# EAGLE design M6RF-315 (EAGLE 6.1)
DESIGNER: Sandor Szilvasi; PAGE1: Cover Page; PAGE2: Radio and Antenna; REVISION: A; TITLE: M6-RF315

## Sheet 1 of 2
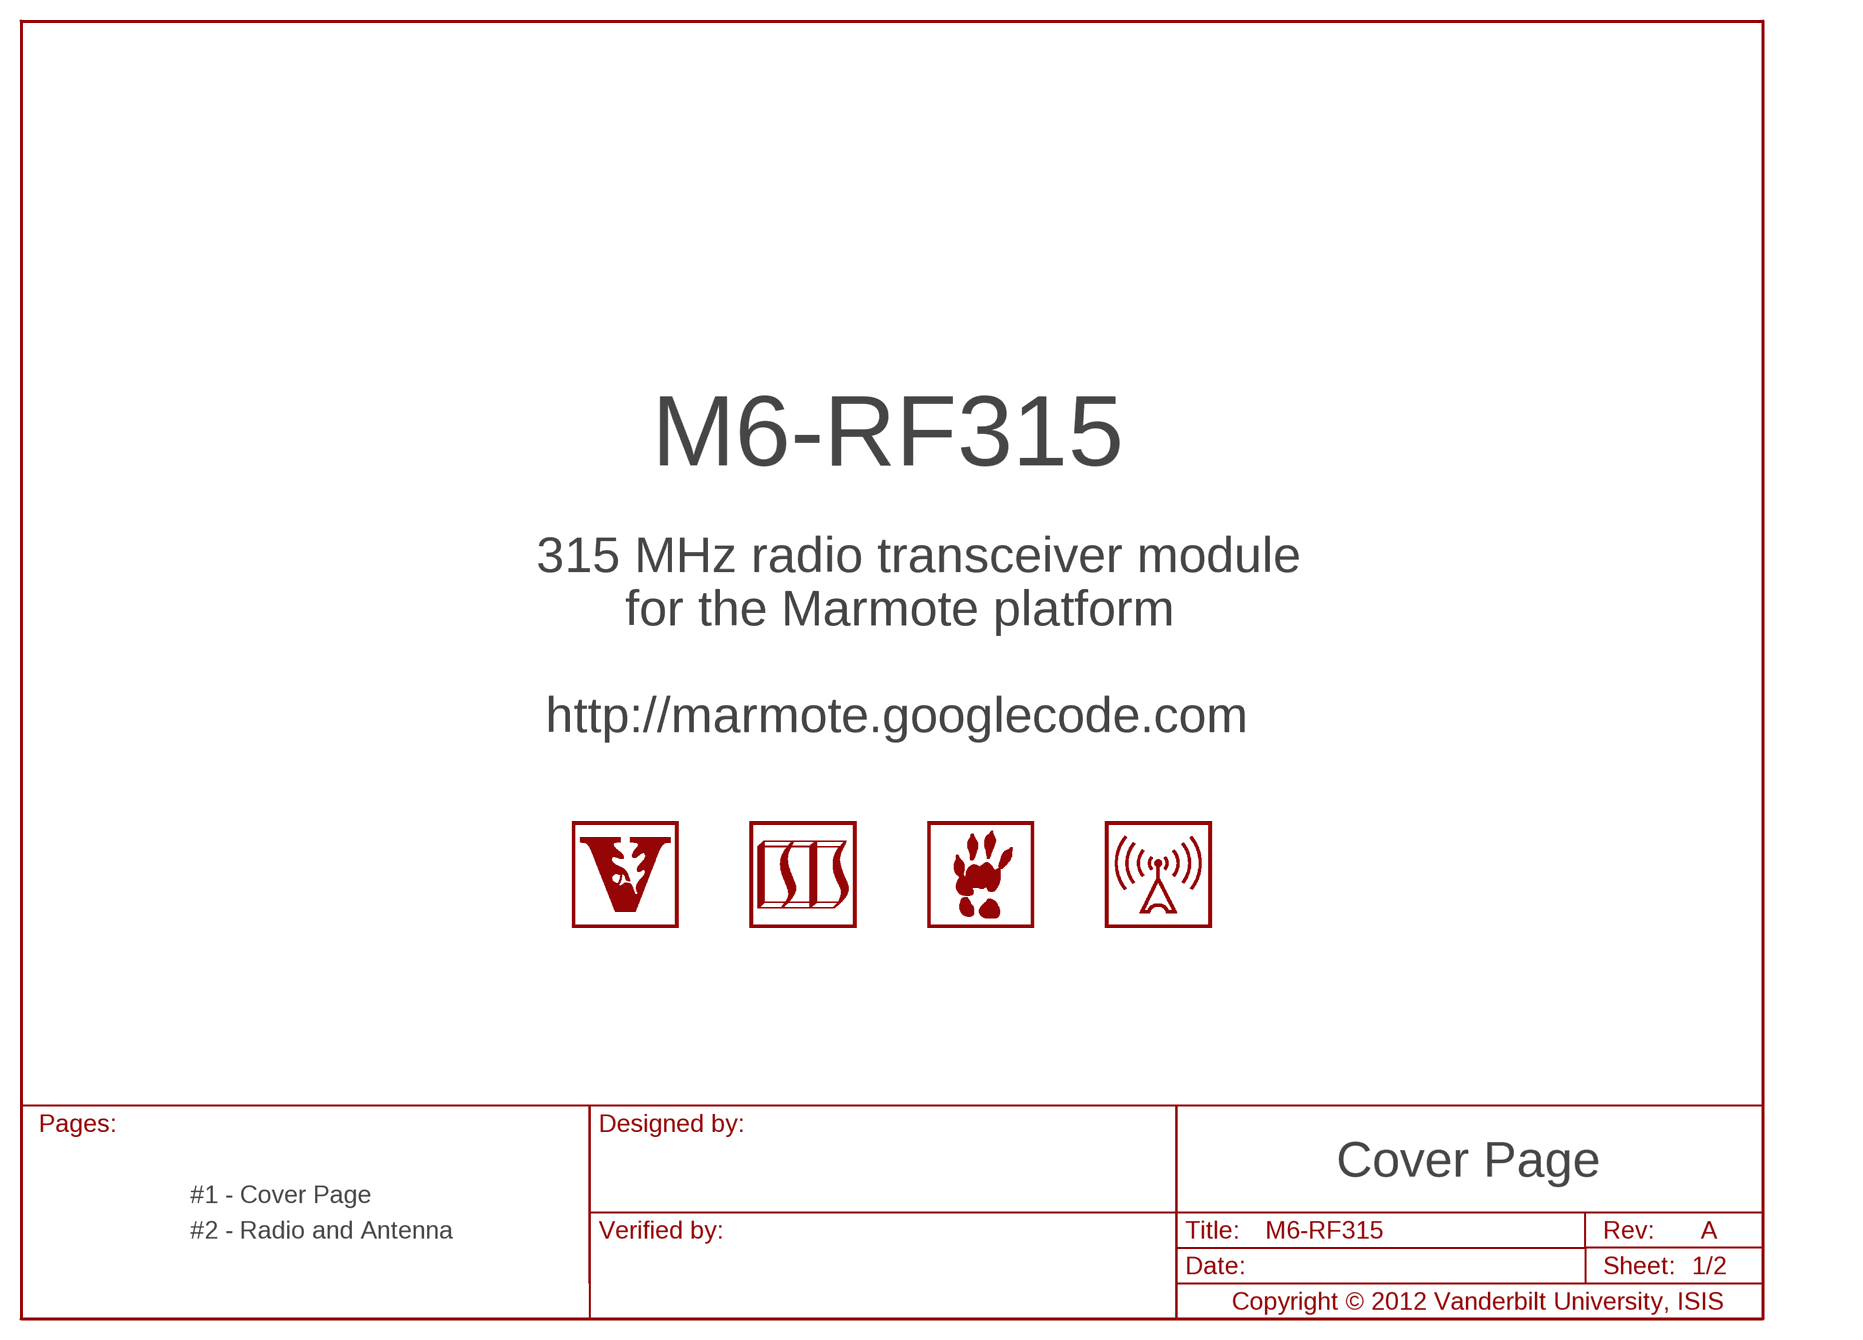
[diagram p0: schematic, sheet 1]

### Parts
LOGO1  LOGO-ISIS-600MIL-10MM-CU  [LOGO-ISIS-10MM-COPPER]
LOGO2  LOGO-MARMOTE-600MIL-10MM-CU  [LOGO-MARMOTE-10MM-COPPER]
LOGO3  LOGO-VANDERBILT-600MIL-10MM-CU  [LOGO-VANDERBILT-10MM-COPPER]
U$3  LOGO-RADIO-2-600MIL-10MM-CU  [LOGO-RADIO-2-10MM-COPPER]

### Notes on the sheet
- 315 MHz radio transceiver module
- for the Marmote platform
- http://marmote.googlecode.com

## Sheet 2 of 2
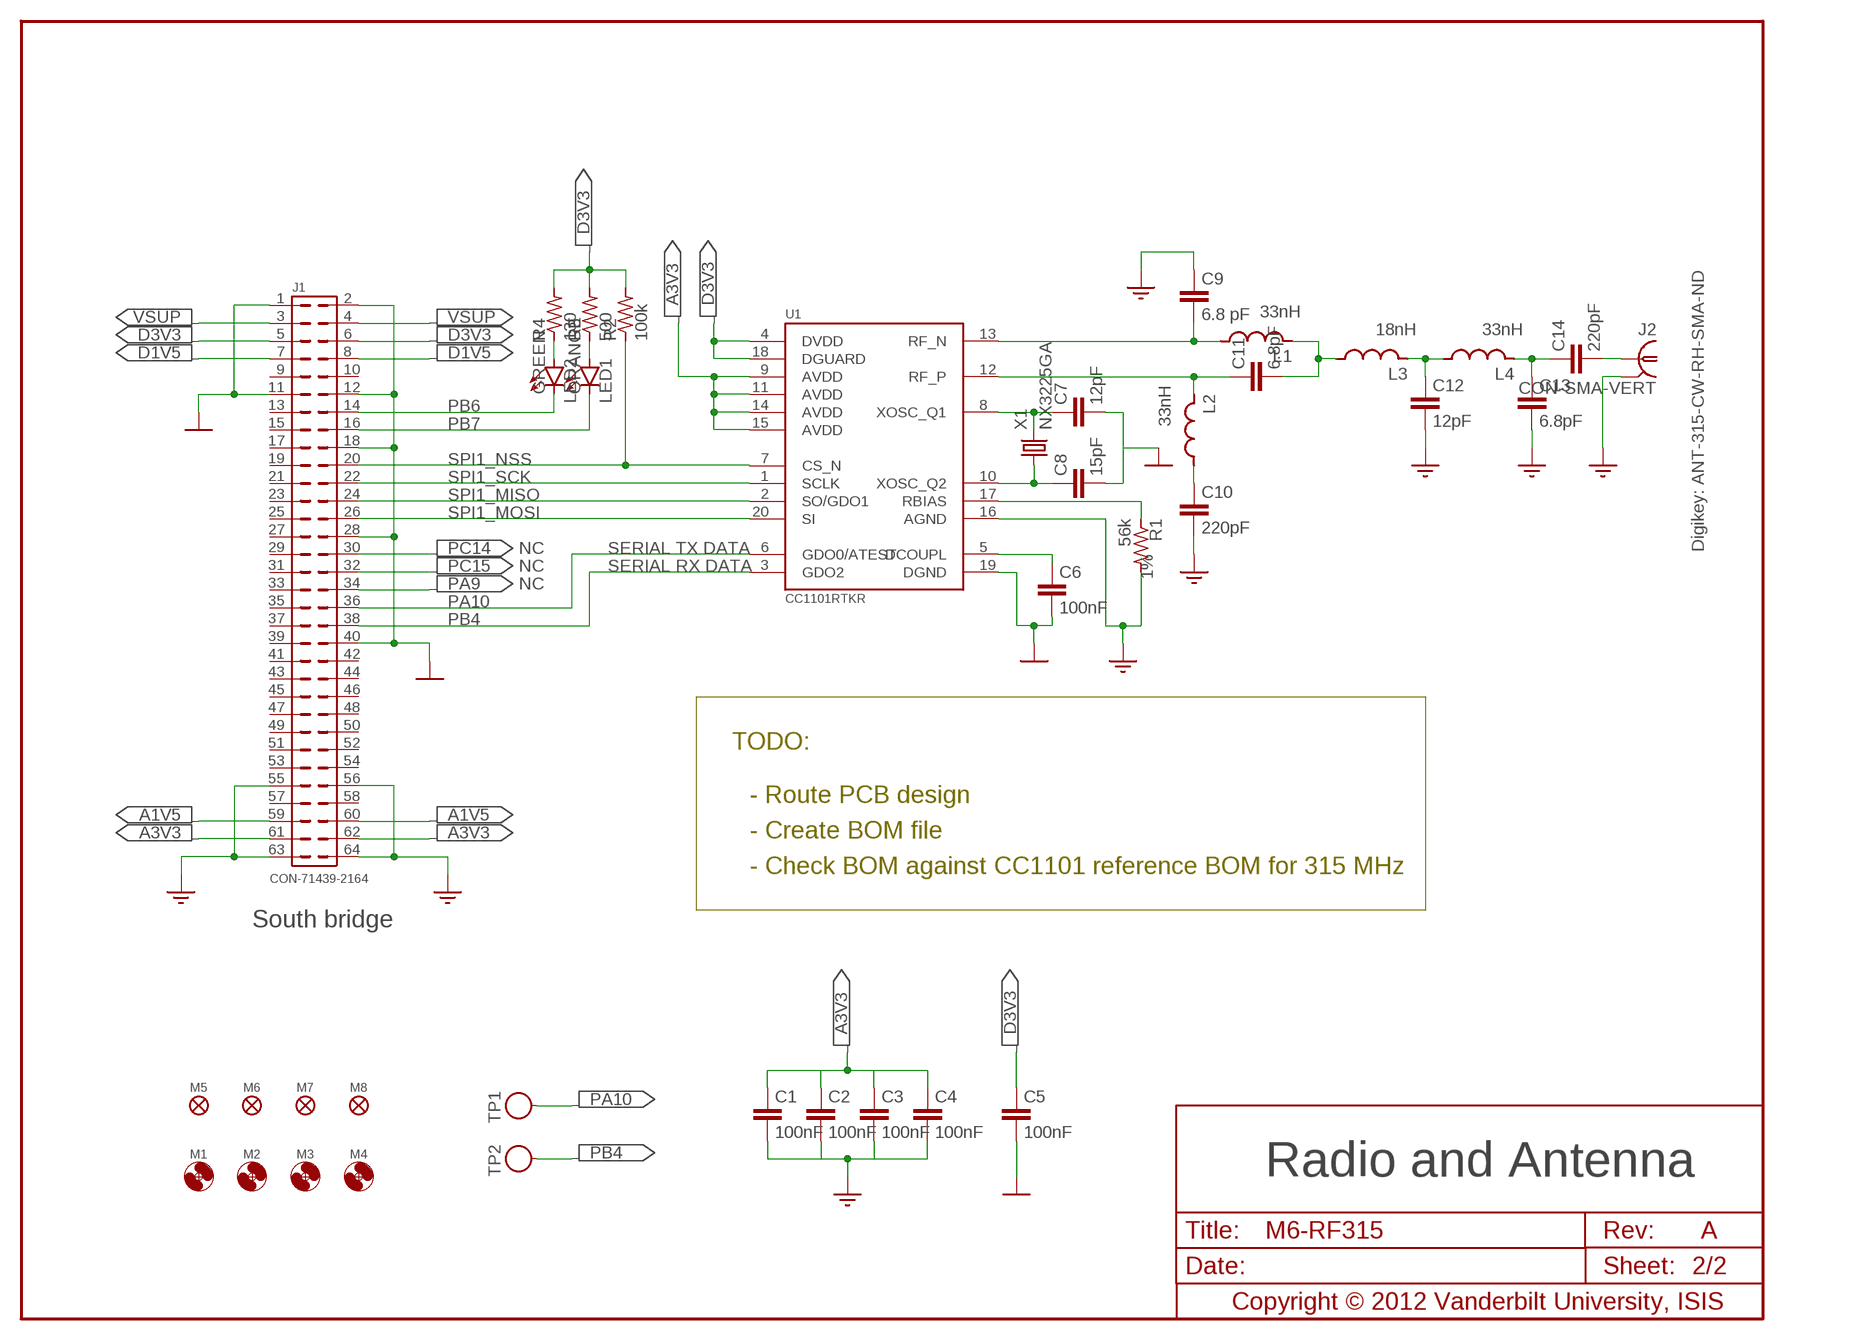
[diagram p1: schematic, sheet 2]

### Parts
C1  100nF  C0603  [C0603]
C2  100nF  C0603  [C0603]
C3  100nF  C0603  [C0603]
C4  100nF  C0603  [C0603]
C5  100nF  C0603  [C0603]
C6  100nF  C0603  [C0603]
C7  12pF  C0603  [C0603]
C8  15pF  C0603  [C0603]
C9  6.8 pF  C0603  [C0603]
C10  220pF  C0603  [C0603]
C11  6.8pF  C0603  [C0603]
C12  12pF  C0603  [C0603]
C13  6.8pF  C0603  [C0603]
C14  220pF  C0603  [C0603]
J1  CON-71439-2164  [71439-XX64-BOT]
J2  CON-SMA-VERT  [SMA-VERT]
L1  33nH  L0603  [L0603]
L2  33nH  L0603  [L0603]
L3  18nH  L0603  [L0603]
L4  33nH  L0603  [L0603]
LED1  LED0603  [LED0603]
LED2  LED0603  [LED0603]
M1  MOUNT-HOLE3.3  [3,3]
M2  MOUNT-HOLE3.3  [3,3]
M3  MOUNT-HOLE3.3  [3,3]
M4  MOUNT-HOLE3.3  [3,3]
M5  FIDUCIAL1X2  [FIDUCIAL-1X2]
M6  FIDUCIAL1X2  [FIDUCIAL-1X2]
M7  FIDUCIAL1X2  [FIDUCIAL-1X2]
M8  FIDUCIAL1X2  [FIDUCIAL-1X2]
R1  56k  R0603  [R0603]
R2  100k  R0603  [R0603]
R3  500  R0603  [R0603]
R4  130  R0603  [R0603]
TP1  TESTPOINT-RED  [TESTPOINT]
TP2  TESTPOINT-RED  [TESTPOINT]
U1  CC1101RTKR  [QFN-20]
X1  NX3225GA  [NX3225GA]

### Nets
A1V5: J1.59 J1.60
A3V3: C1.1 C2.1 C3.1 C4.1 J1.61 J1.62 U1.9(AVDD) U1.11(AVDD) U1.14(AVDD) U1.15(AVDD)
AGND: C1.2 C2.2 C3.2 C4.2 C9.1 C10.2 C12.2 C13.2 J1.55 J1.56 J1.63 J1.64 J2.2(GND) R1.2 U1.16(AGND)
D1V5: J1.7 J1.8
D3V3: C5.1 J1.5 J1.6 R2.2 R3.2 R4.2 U1.4(DVDD) U1.18(DGUARD)
DGND: C5.2 C6.2 C7.2 C8.2 J1.1 J1.2 J1.11 J1.12 J1.18 J1.28 J1.40 U1.19(DGND)
N$1: LED1.A R3.1
N$2: C12.1 L3.2 L4.1
N$3: R1.1 U1.17(RBIAS)
N$4: C6.1 U1.5(DCOUPL)
N$6: C8.1 U1.10(XOSC_Q2) X1.1
N$7: C7.1 U1.8(XOSC_Q1) X1.3
N$8: C11.1 L2.2 U1.12(RF_P)
N$9: C9.2 L1.1 U1.13(RF_N)
N$10: C11.2 L1.2 L3.1
N$11: C13.1 C14.1 L4.2
N$12: C14.2 J2.1
N$13: C10.1 L2.1
N$19: LED2.A R4.1
PA9: J1.34
PA10: J1.36 TP1.1 U1.6(GDO0/ATEST)
PB4: J1.38 TP2.1 U1.3(GDO2)
PB6: J1.14 LED2.C
PB7: J1.16 LED1.C
PC14: J1.30
PC15: J1.32
SPI1_MISO: J1.24 U1.2(SO/GDO1)
SPI1_MOSI: J1.26 U1.20(SI)
SPI1_NSS: J1.20 R2.1 U1.7(CS_N)
SPI1_SCK: J1.22 U1.1(SCLK)
VSUP: J1.3 J1.4
Unconnected: J1.9 J1.10 J1.13 J1.15 J1.17 J1.19 J1.21 J1.23 J1.25 J1.27 J1.29 J1.31 J1.33 J1.35 J1.37 J1.39 J1.41 J1.42 J1.43 J1.44 J1.45 J1.46 J1.47 J1.48 J1.49 J1.50 J1.51 J1.52 J1.53 J1.54 J1.57 J1.58 U1.E$1(AGND) U1.E$2(AGND) U1.E$3(AGND) U1.E$4(AGND)

### Notes on the sheet
- Digikey: ANT-315-CW-RH-SMA-ND
- NC | SERIAL TX DATA
- NC | SERIAL RX DATA
- NC
- TODO:
- - Route PCB design
- - Create BOM file
- - Check BOM against CC1101 reference BOM for 315 MHz
- South bridge

## Power pins joined to a net without a drawn wire
DGND: X1.2(DGND) X1.4(DGND)
GND: J2.3(GND) J2.4(GND) J2.5(GND)

## Library data of the parts
C1-C8 = M6-RF315:C: CAPACITOR
C9 = M6-RF315:C: CAPACITOR; FUNCTION: RF balun/matching capacitor
C10 = M6-RF315:C: CAPACITOR; FUNCTION: RF balun DC blocking capacitor
C11 = M6-RF315:C: CAPACITOR; FUNCTION: RF balun/matching capacitors
C12 = M6-RF315:C: CAPACITOR; FUNCTION: RF LC filter/matching filter capacitor
C13 = M6-RF315:C: CAPACITOR; FUNCTION: RF LC filter/matching capacitor
C14 = M6-RF315:C: CAPACITOR; FUNCTION: RF LC filter DC blocking capacitor
J1 = M6-RF315:CON-71439: Board-to-Board Connector 1.00mm (.039") Mezzanine IEEE 1386 Receptacle - Dual Row 64-pin, SMT, Vertical Stacking Source: http://www.molex.com/molex/products/datasheet.jsp?part=active/0714392164_PCB_RECEPTACLES.xml&channel=Products; DIGI-KEY#: WM17222-ND; MATED-STACKING-HEIGHT: 13mm; MF: Molex; MPN: 71439-2164
J2 = M6-RF315:CON-SMA-VERT: SMA vertical PCB thrue hole jack Source: Lighthorse Technologies, inc. SASF54GT.pdf; DIGI-KEY#: A97594-ND; MF: TE Connectivity; MPN: 5-1814832-1
L1 L2 = M6-RF315:L: INDUCTOR; FUNCTION: RF balun/matching inductor
L3 L4 = M6-RF315:L: INDUCTOR; FUNCTION: RF LC filter/matching filter inductor
LED1 = M6-RF315:LED: LED; COLOR: ORANGE; DIGI-KEY#: 754-1120-1-ND; MF: Kingbright; MILLICANDELA: 240 mcd; MPN: APT1608SECK
LED2 = M6-RF315:LED: LED; COLOR: GREEN; DIGI-KEY#: 754-1118-1-ND; MF: Kingbright; MILLICANDELA: 70 mcd; MPN: APT1608MGC
LOGO1 = M6-RF315:LOGO-ISIS-600MIL: ISIS Logo Official logo of the Institute for Software Integrated Systems (ISIS), Vanderbilt as of 2011 Generated from 360 x 360 px bitmap and scaled to 600 x 600 mil v1.0 Initial design
LOGO2 = M6-RF315:LOGO-MARMOTE-600MIL: Marmote Platform Logo Preliminary logo for the Marmote Platform (http://marmote.googlecode.com) Generated from 360 x 360 px bitmap and scaled to 600 x 600 mil v1.1 Source bitmap smoothened v1.0 Initial design
LOGO3 = M6-RF315:LOGO-VANDERBILT-600MIL: Vanderbilt Logo Official Framed Vanderbilt Logo Generated from 360 x 360 px bitmap and scaled to 600 x 600 mil v1.1 Source bitmap smoothened v1.0 Initial design
M1-M4 = M6-RF315:MOUNT-HOLE: MOUNTING HOLE with drill center marker
M5-M8 = M6-RF315:FIDUCIAL: Fiducial Alignment Points Various fiducial points for machine vision alignment.
R1 = M6-RF315:R: RESISTOR; TOLERANCE: 1%
R2-R4 = M6-RF315:R: RESISTOR
TP1 TP2 = M6-RF315:TESTPOINT: Test Point Keystone compact through hole mount test point for SUPPLY and GROUND signals Terminal: .015 (.38) × .032 (.81) thick Phosphor Bronze Wire, Silver Plate Base: Nylon 46, UL Rated 94V-0 Mtg. Hole: .063 (1.6) Diameter Source: http://www.keyelco.com/pdfs/M55p51.pdf; DIGI-KEY#: 5005K-ND; MF: Keystone; MPN: 5005
U1 = M6-RF315:CC1101: CC1101 Texas Instruments CC1101 Radio Chip. Source: http://www.ti.com/lit/gpn/cc1101; DIGI-KEY#: 296-21981-1-ND; MF: Texas Instruments; MPN: CC1101RTKR
U$3 = M6-RF315:LOGO-RADIO-2-600MIL: Radio Logo Preliminary logo for the Marmote platform analog radio front-end module. Generated from 360 x 360 px bitmap and scaled to 600 x 600 mil v1.0 Initial design
X1 = M6-RF315:NX3225GA: NX3225GA Crystal oscillator NDK NX3225GA small surface-mount type crystal unit in compact and thin 3.2 x 2.5 x 0.75 mm package. Source: http://www.ndk.com/images/products/catalog/c_NX3225GA-STD-CRG-1_e.pdf; DIGI-KEY#: 644-1157-1-ND; MF: NDK; MFN: NX3225GA-16.000M-STD-CRG-1

## Board
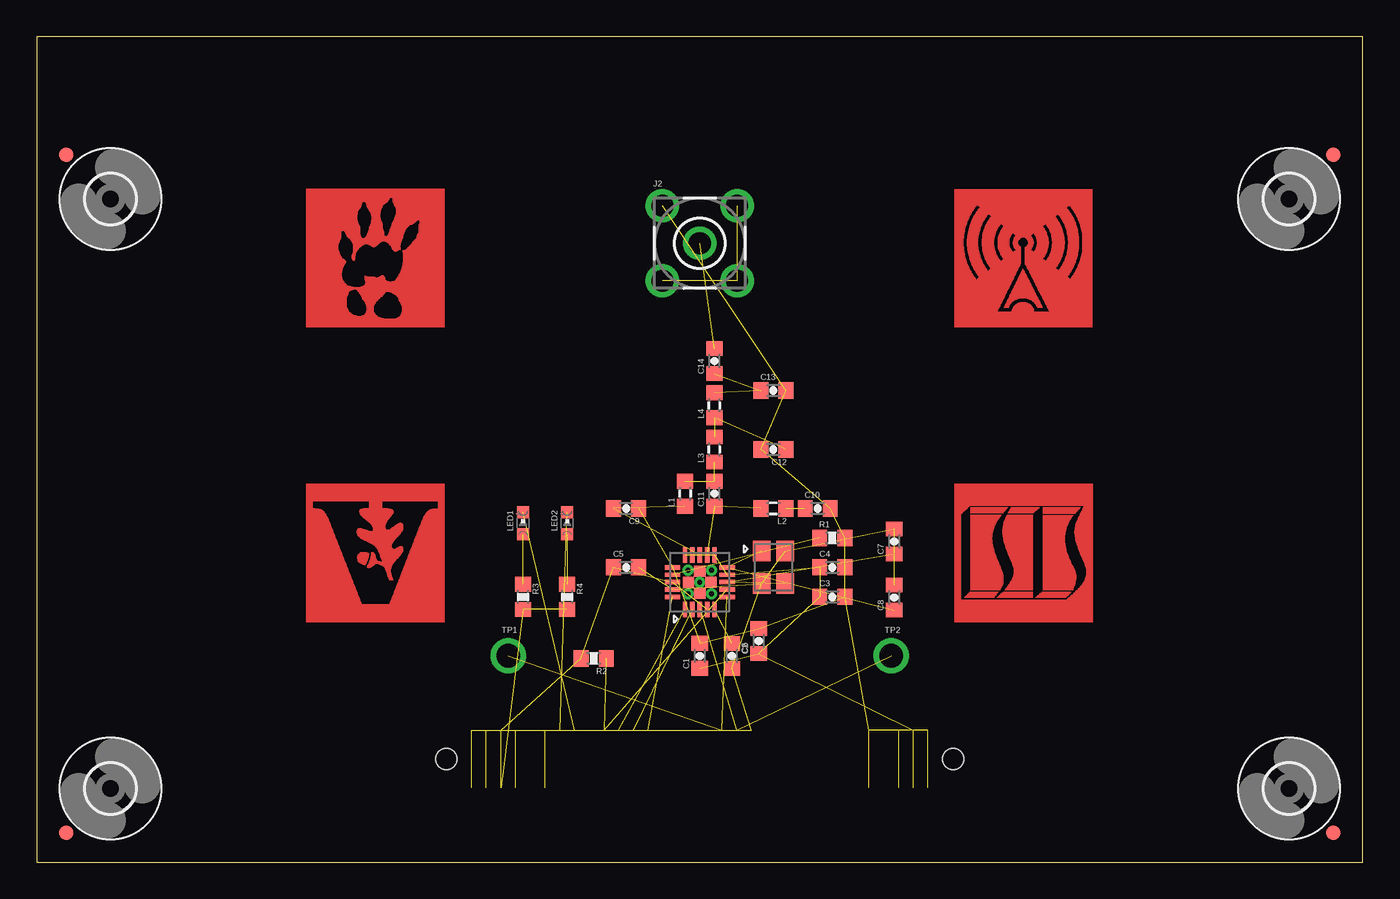
[diagram p2: board, top side]
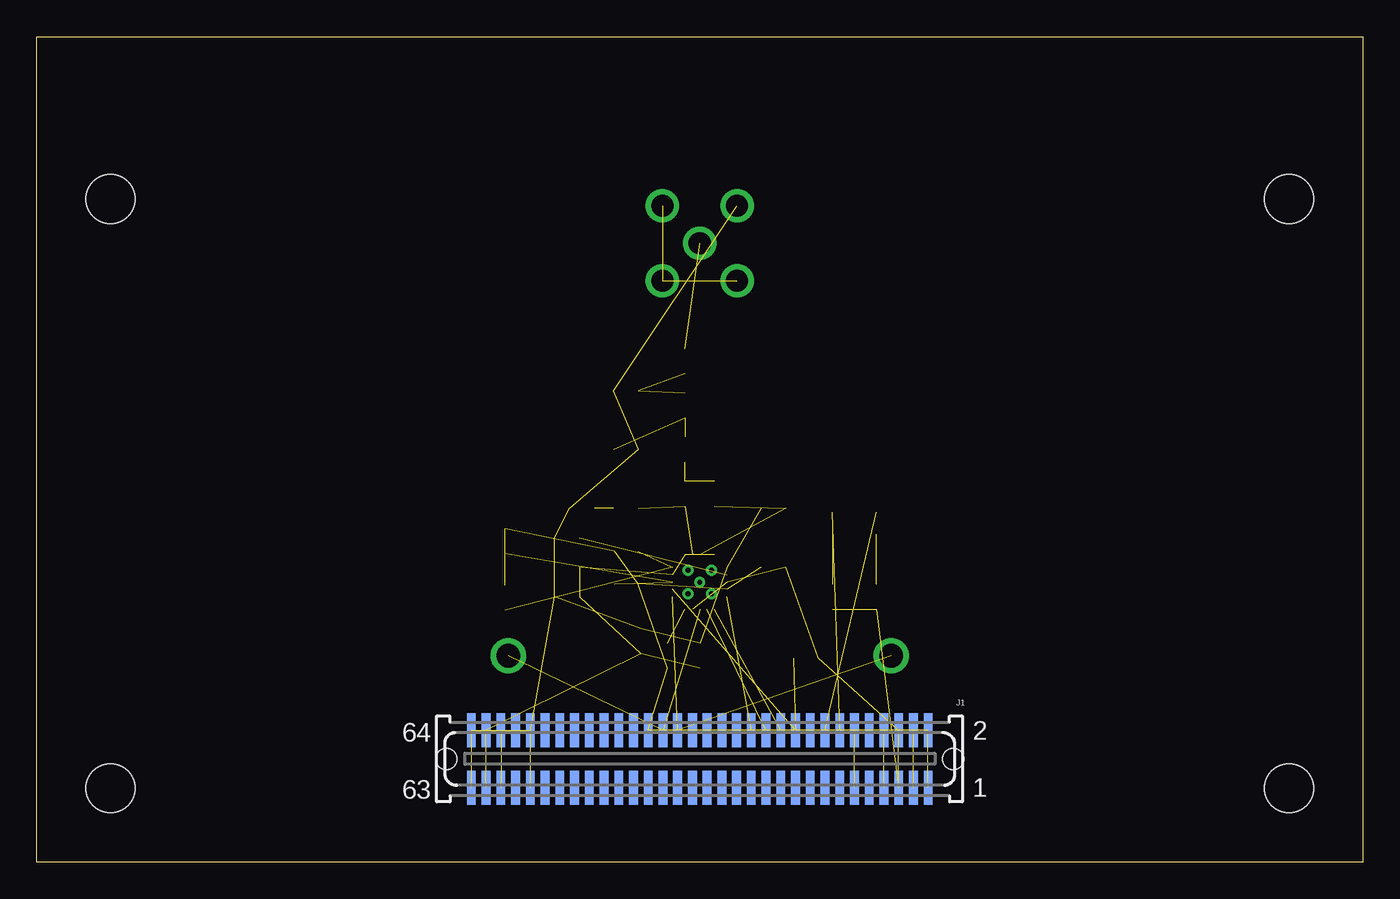
[diagram p3: board, bottom side, seen from below]

Size 90 x 56 mm. Coordinates in mm from the lower left corner, seen from the top.
Outline: 0,0 90,0 90,56 0,56 0,0
Copper layers (1*16): Top 0.035mm / dielectric 1.5mm / Bottom 0.035mm
Design rules: minimum track width 10mil, minimum drill 24mil, track to track 8mil, track to pad 8mil, pad to pad 8mil, via to via 8mil, smd to smd 8mil, copper to edge 40mil, drill to drill 8mil, minimum pad ring 10mil, minimum via ring 8mil, stop-mask expansion 4mil, vias tented up to drill 0mil, thermal gap 10mil

### Footprints (pad centres in the part's own frame; a part is rotated, then mirrored left to right if it is on the bottom)
C0603 = smd 1 x 1.1: 1 -0.85,0; 2 0.85,0
71439-XX64-BOT = smd 0.6 x 2.3: 1 -15.5,1.96; 2 -15.5,-1.96; 3 -14.5,1.96; 4 -14.5,-1.96; 5 -13.5,1.96; 6 -13.5,-1.96; 7 -12.5,1.96; 8 -12.5,-1.96; 9 -11.5,1.96; 10 -11.5,-1.96; 11 -10.5,1.96; 12 -10.5,-1.96; 13 -9.5,1.96; 14 -9.5,-1.96; 15 -8.5,1.96; 16 -8.5,-1.96; 17 -7.5,1.96; 18 -7.5,-1.96; 19 -6.5,1.96; 20 -6.5,-1.96; 21 -5.5,1.96; 22 -5.5,-1.96; 23 -4.5,1.96; 24 -4.5,-1.96; 25 -3.5,1.96; 26 -3.5,-1.96; 27 -2.5,1.96; 28 -2.5,-1.96; 29 -1.5,1.96; 30 -1.5,-1.96; 31 -0.5,1.96; 32 -0.5,-1.96; 33 0.5,1.96; 34 0.5,-1.96; 35 1.5,1.96; 36 1.5,-1.96; 37 2.5,1.96; 38 2.5,-1.96; 39 3.5,1.96; 40 3.5,-1.96; 41 4.5,1.96; 42 4.5,-1.96; 43 5.5,1.96; 44 5.5,-1.96; 45 6.5,1.96; 46 6.5,-1.96; 47 7.5,1.96; 48 7.5,-1.96; 49 8.5,1.96; 50 8.5,-1.96; 51 9.5,1.96; 52 9.5,-1.96; 53 10.5,1.96; 54 10.5,-1.96; 55 11.5,1.96; 56 11.5,-1.96; 57 12.5,1.96; 58 12.5,-1.96; 59 13.5,1.96; 60 13.5,-1.96; 61 14.5,1.96; 62 14.5,-1.96; 63 15.5,1.96; 64 15.5,-1.96 | hole 1.4: -17.2,0; 17.2,0
SMA-VERT = drill 1.5 pad 2.2: 1 0,0; 2 -2.54,2.54; 3 2.54,2.54; 4 2.54,-2.54; 5 -2.54,-2.54
L0603 = smd 1 x 1.1: 1 -0.85,0; 2 0.85,0
LED0603 = smd 0.8 x 0.8: A 0,0.75; C 0,-0.75
3,3 = hole 3.3: 0,0
FIDUCIAL-1X2 = smd 1 x 1: 1 0,0
R0603 = smd 1 x 1.1: 1 -0.85,0; 2 0.85,0
TESTPOINT = drill 1.6: 1 0,0
QFN-20 = smd 1.05 x 0.3: 1 -1.85,1; 2 -1.85,0.5; 3 -1.85,0; 4 -1.85,-0.5; 5 -1.85,-1; 11 1.85,-1; 12 1.85,-0.5; 13 1.85,0; 14 1.85,0.5; 15 1.85,1 | smd 0.3 x 1.05: 6 -1,-1.85; 7 -0.5,-1.85; 8 0,-1.85; 9 0.5,-1.85; 10 1,-1.85; 16 1,1.85; 17 0.5,1.85; 18 0,1.85; 19 -0.5,1.85; 20 -1,1.85 | smd 0.75 x 0.75: E$1 -0.75,0; E$2 0,-0.75; E$3 0.75,0; E$4 0,0.75
NX3225GA = smd 1.4 x 1.2: 1 -1.1,-0.8; 2 1.1,-0.8; 3 1.1,0.8; 4 -1.1,0.8

### Placement (x,y rotation side)
C1  45,14 90 top
C2  49,15 90 top
C3  54,18 0 top
C4  54,20 0 top
C5  40,20 0 top
C6  47.18,13.99 270 top
C7  58.2,21.76 90 top
C8  58.2,17.95 90 top
C9  40,24 180 top
C10  53,24 0 top
C11  46,25 90 top
C12  50,28 180 top
C13  50,32 0 top
C14  46,34 90 top
J1  45,7 180 bottom
J2  45,42 0 top
L1  44,25 90 top
L2  50,24 180 top
L3  46,28 90 top
L4  46,31 90 top
LED1  33,23 180 top
LED2  36,23 180 top
LOGO1  62,16 0 top
LOGO2  18,36 0 top
LOGO3  18,16 0 top
M1  5,5 0 top
M2  5,45 0 top
M3  85,45 0 top
M4  85,5 0 top
M5  2,2 0 top
M6  2,48 0 top
M7  88,48 0 top
M8  88,2 0 top
R1  54,22 0 top
R2  37.8,13.82 180 top
R3  33,18 270 top
R4  36,18 270 top
TP1  32,14 0 top
TP2  58,14 0 top
U1  45,19 90 top
U$3  62,36 0 top
X1  50,20 270 top

### Tracks (layer width: path | path; a pad name or v marks a point on that pad's centre or on a via)
A1V5  (1 unrouted)
A3V3  (9 unrouted)
AGND  (14 unrouted)
D1V5  (1 unrouted)
D3V3  (7 unrouted)
DGND  (13 unrouted)
GND  (2 unrouted)
N$1  (1 unrouted)
N$2  (2 unrouted)
N$3  (1 unrouted)
N$4  (1 unrouted)
N$6  (2 unrouted)
N$7  (2 unrouted)
N$8  (2 unrouted)
N$9  (2 unrouted)
N$10  (2 unrouted)
N$11  (2 unrouted)
N$12  (1 unrouted)
N$13  (1 unrouted)
N$14  (via drill 0.33)
  other vias: 44.2,18.2
N$15  (via drill 0.33)
  other vias: 45.8,18.2
N$16  (via drill 0.33)
  other vias: 45.8,19.8
N$17  (via drill 0.33)
  other vias: 44.2,19.8
N$18  (via drill 0.33)
  other vias: 45,19
N$19  (1 unrouted)
PA10  (2 unrouted)
PB4  (2 unrouted)
PB6  (1 unrouted)
PB7  (1 unrouted)
SPI1_MISO  (1 unrouted)
SPI1_MOSI  (1 unrouted)
SPI1_NSS  (2 unrouted)
SPI1_SCK  (1 unrouted)
VSUP  (1 unrouted)